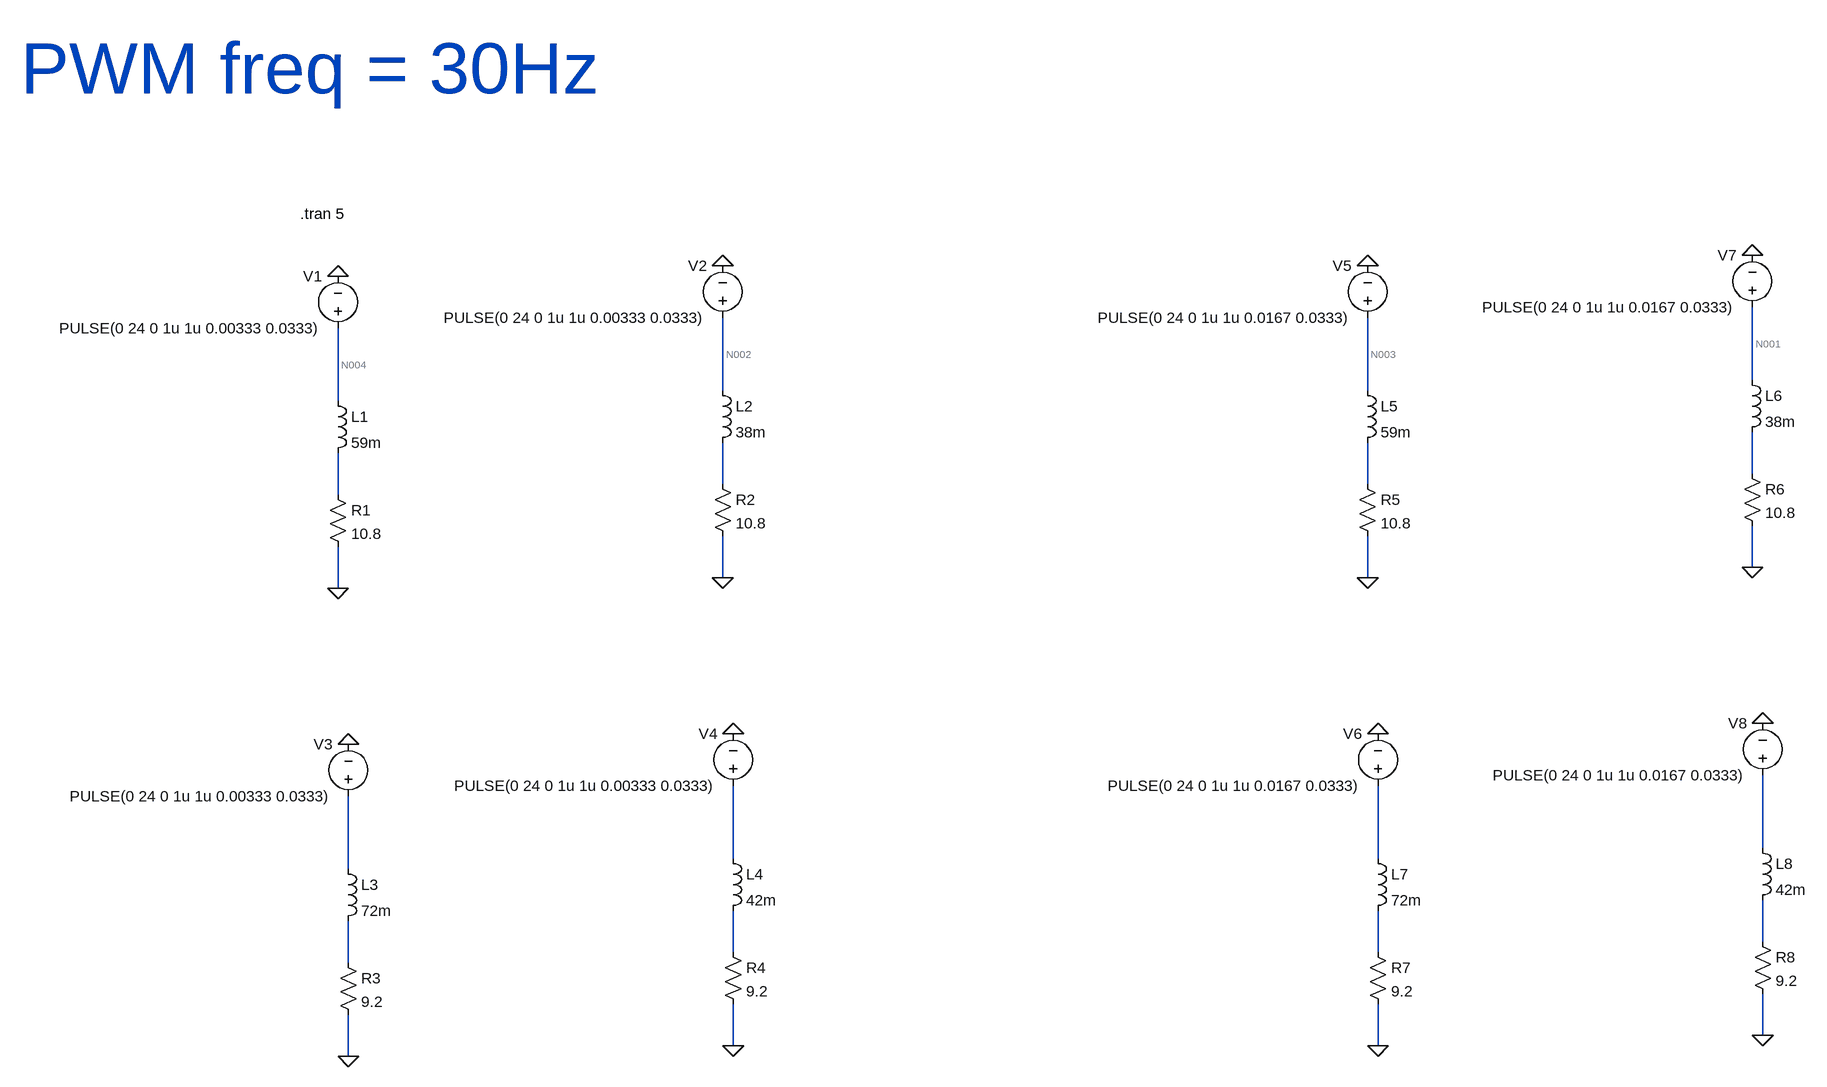
[diagram p0: schematic Sensing_Concept.asc]
Sensing_Concept.asc, the LTspice schematic file:
Version 4
SHEET 1 2360 1140
WIRE 2272 80 2272 -32
WIRE 688 96 688 -16
WIRE 1680 96 1680 -16
WIRE 96 112 96 0
WIRE 2272 224 2272 160
WIRE 688 240 688 176
WIRE 1680 240 1680 176
WIRE 96 256 96 192
WIRE 2272 368 2272 304
WIRE 688 384 688 320
WIRE 1680 384 1680 320
WIRE 96 400 96 336
WIRE 2288 800 2288 688
WIRE 704 816 704 704
WIRE 1696 816 1696 704
WIRE 112 832 112 720
WIRE 2288 944 2288 880
WIRE 704 960 704 896
WIRE 1696 960 1696 896
WIRE 112 976 112 912
WIRE 2288 1088 2288 1024
WIRE 704 1104 704 1040
WIRE 1696 1104 1696 1040
WIRE 112 1120 112 1056
FLAG 96 400 0
FLAG 96 -80 0
FLAG 688 384 0
FLAG 688 -96 0
FLAG 112 1120 0
FLAG 112 640 0
FLAG 704 1104 0
FLAG 704 624 0
FLAG 1680 384 0
FLAG 1680 -96 0
FLAG 2272 368 0
FLAG 1696 1104 0
FLAG 2288 1088 0
FLAG 1696 624 0
FLAG 2272 -112 0
FLAG 2288 608 0
SYMBOL ind 80 96 R0
SYMATTR InstName L1
SYMATTR Value 59m
SYMBOL res 80 240 R0
SYMATTR InstName R1
SYMATTR Value 10.8
SYMBOL voltage 96 16 R180
WINDOW 0 24 96 Left 2
WINDOW 3 24 16 Left 2
WINDOW 123 0 0 Left 0
WINDOW 39 0 0 Left 0
SYMATTR InstName V1
SYMATTR Value PULSE(0 24 0 1u 1u 0.00333 0.0333)
SYMBOL ind 672 80 R0
SYMATTR InstName L2
SYMATTR Value 38m
SYMBOL res 672 224 R0
SYMATTR InstName R2
SYMATTR Value 10.8
SYMBOL voltage 688 0 R180
WINDOW 0 24 96 Left 2
WINDOW 3 24 16 Left 2
WINDOW 123 0 0 Left 0
WINDOW 39 0 0 Left 0
SYMATTR InstName V2
SYMATTR Value PULSE(0 24 0 1u 1u 0.00333 0.0333)
SYMBOL ind 96 816 R0
SYMATTR InstName L3
SYMATTR Value 72m
SYMBOL res 96 960 R0
SYMATTR InstName R3
SYMATTR Value 9.2
SYMBOL voltage 112 736 R180
WINDOW 0 24 96 Left 2
WINDOW 3 24 16 Left 2
WINDOW 123 0 0 Left 0
WINDOW 39 0 0 Left 0
SYMATTR InstName V3
SYMATTR Value PULSE(0 24 0 1u 1u 0.00333 0.0333)
SYMBOL ind 688 800 R0
SYMATTR InstName L4
SYMATTR Value 42m
SYMBOL res 688 944 R0
SYMATTR InstName R4
SYMATTR Value 9.2
SYMBOL voltage 704 720 R180
WINDOW 0 24 96 Left 2
WINDOW 3 24 16 Left 2
WINDOW 123 0 0 Left 0
WINDOW 39 0 0 Left 0
SYMATTR InstName V4
SYMATTR Value PULSE(0 24 0 1u 1u 0.00333 0.0333)
SYMBOL ind 1664 80 R0
SYMATTR InstName L5
SYMATTR Value 59m
SYMBOL res 1664 224 R0
SYMATTR InstName R5
SYMATTR Value 10.8
SYMBOL voltage 1680 0 R180
WINDOW 0 24 96 Left 2
WINDOW 3 24 16 Left 2
WINDOW 123 0 0 Left 0
WINDOW 39 0 0 Left 0
SYMATTR InstName V5
SYMATTR Value PULSE(0 24 0 1u 1u 0.0167 0.0333)
SYMBOL ind 2256 64 R0
SYMATTR InstName L6
SYMATTR Value 38m
SYMBOL res 2256 208 R0
SYMATTR InstName R6
SYMATTR Value 10.8
SYMBOL ind 1680 800 R0
SYMATTR InstName L7
SYMATTR Value 72m
SYMBOL res 1680 944 R0
SYMATTR InstName R7
SYMATTR Value 9.2
SYMBOL ind 2272 784 R0
SYMATTR InstName L8
SYMATTR Value 42m
SYMBOL res 2272 928 R0
SYMATTR InstName R8
SYMATTR Value 9.2
SYMBOL voltage 1696 720 R180
WINDOW 0 24 96 Left 2
WINDOW 3 24 16 Left 2
WINDOW 123 0 0 Left 0
WINDOW 39 0 0 Left 0
SYMATTR InstName V6
SYMATTR Value PULSE(0 24 0 1u 1u 0.0167 0.0333)
SYMBOL voltage 2272 -16 R180
WINDOW 0 24 96 Left 2
WINDOW 3 24 16 Left 2
WINDOW 123 0 0 Left 0
WINDOW 39 0 0 Left 0
SYMATTR InstName V7
SYMATTR Value PULSE(0 24 0 1u 1u 0.0167 0.0333)
SYMBOL voltage 2288 704 R180
WINDOW 0 24 96 Left 2
WINDOW 3 24 16 Left 2
WINDOW 123 0 0 Left 0
WINDOW 39 0 0 Left 0
SYMATTR InstName V8
SYMATTR Value PULSE(0 24 0 1u 1u 0.0167 0.0333)
TEXT 38 -176 Left 2 !.tran 5
TEXT -392 -400 Left 7 ;PWM freq = 30Hz

The netlist it stands for:
* Sensing_Concept.asc
L1 N004 N008 59m
R1 N008 0 10.8
V1 N004 0 PULSE(0 24 0 1u 1u 0.00333 0.0333)
L2 N002 N006 38m
R2 N006 0 10.8
V2 N002 0 PULSE(0 24 0 1u 1u 0.00333 0.0333)
L3 N012 N016 72m
R3 N016 0 9.2
V3 N012 0 PULSE(0 24 0 1u 1u 0.00333 0.0333)
L4 N010 N014 42m
R4 N014 0 9.2
V4 N010 0 PULSE(0 24 0 1u 1u 0.00333 0.0333)
L5 N003 N007 59m
R5 N007 0 10.8
V5 N003 0 PULSE(0 24 0 1u 1u 0.0167 0.0333)
L6 N001 N005 38m
R6 N005 0 10.8
L7 N011 N015 72m
R7 N015 0 9.2
L8 N009 N013 42m
R8 N013 0 9.2
V6 N011 0 PULSE(0 24 0 1u 1u 0.0167 0.0333)
V7 N001 0 PULSE(0 24 0 1u 1u 0.0167 0.0333)
V8 N009 0 PULSE(0 24 0 1u 1u 0.0167 0.0333)
.tran 5
* PWM freq = 30Hz
.backanno
.end

* Results of the author's LTspice run, read from the files saved beside the schematic
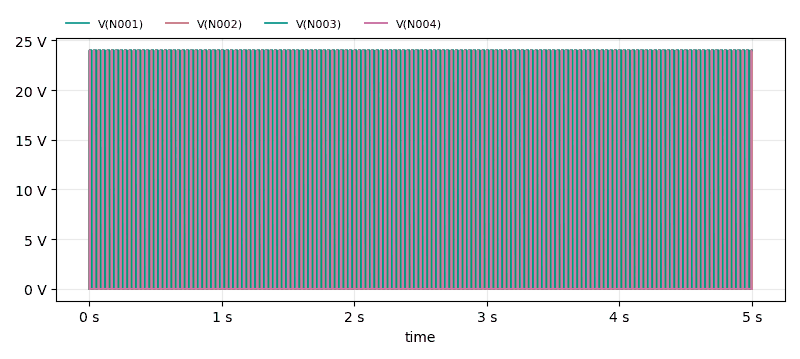
[diagram p1: Transient Analysis of Sensing_Concept.asc, plotted from the saved traces]
* Transient Analysis, 1 run:
*   V(N001): min 0 V, max 24 V, average 12.05 V, rms 17 V, last 24 V
*   V(N002): min 0 V, max 24 V, average 2.414 V, rms 7.612 V, last 0 V
*   V(N003): min 0 V, max 24 V, average 12.05 V, rms 17 V, last 24 V
*   V(N004): min 0 V, max 24 V, average 2.414 V, rms 7.612 V, last 0 V